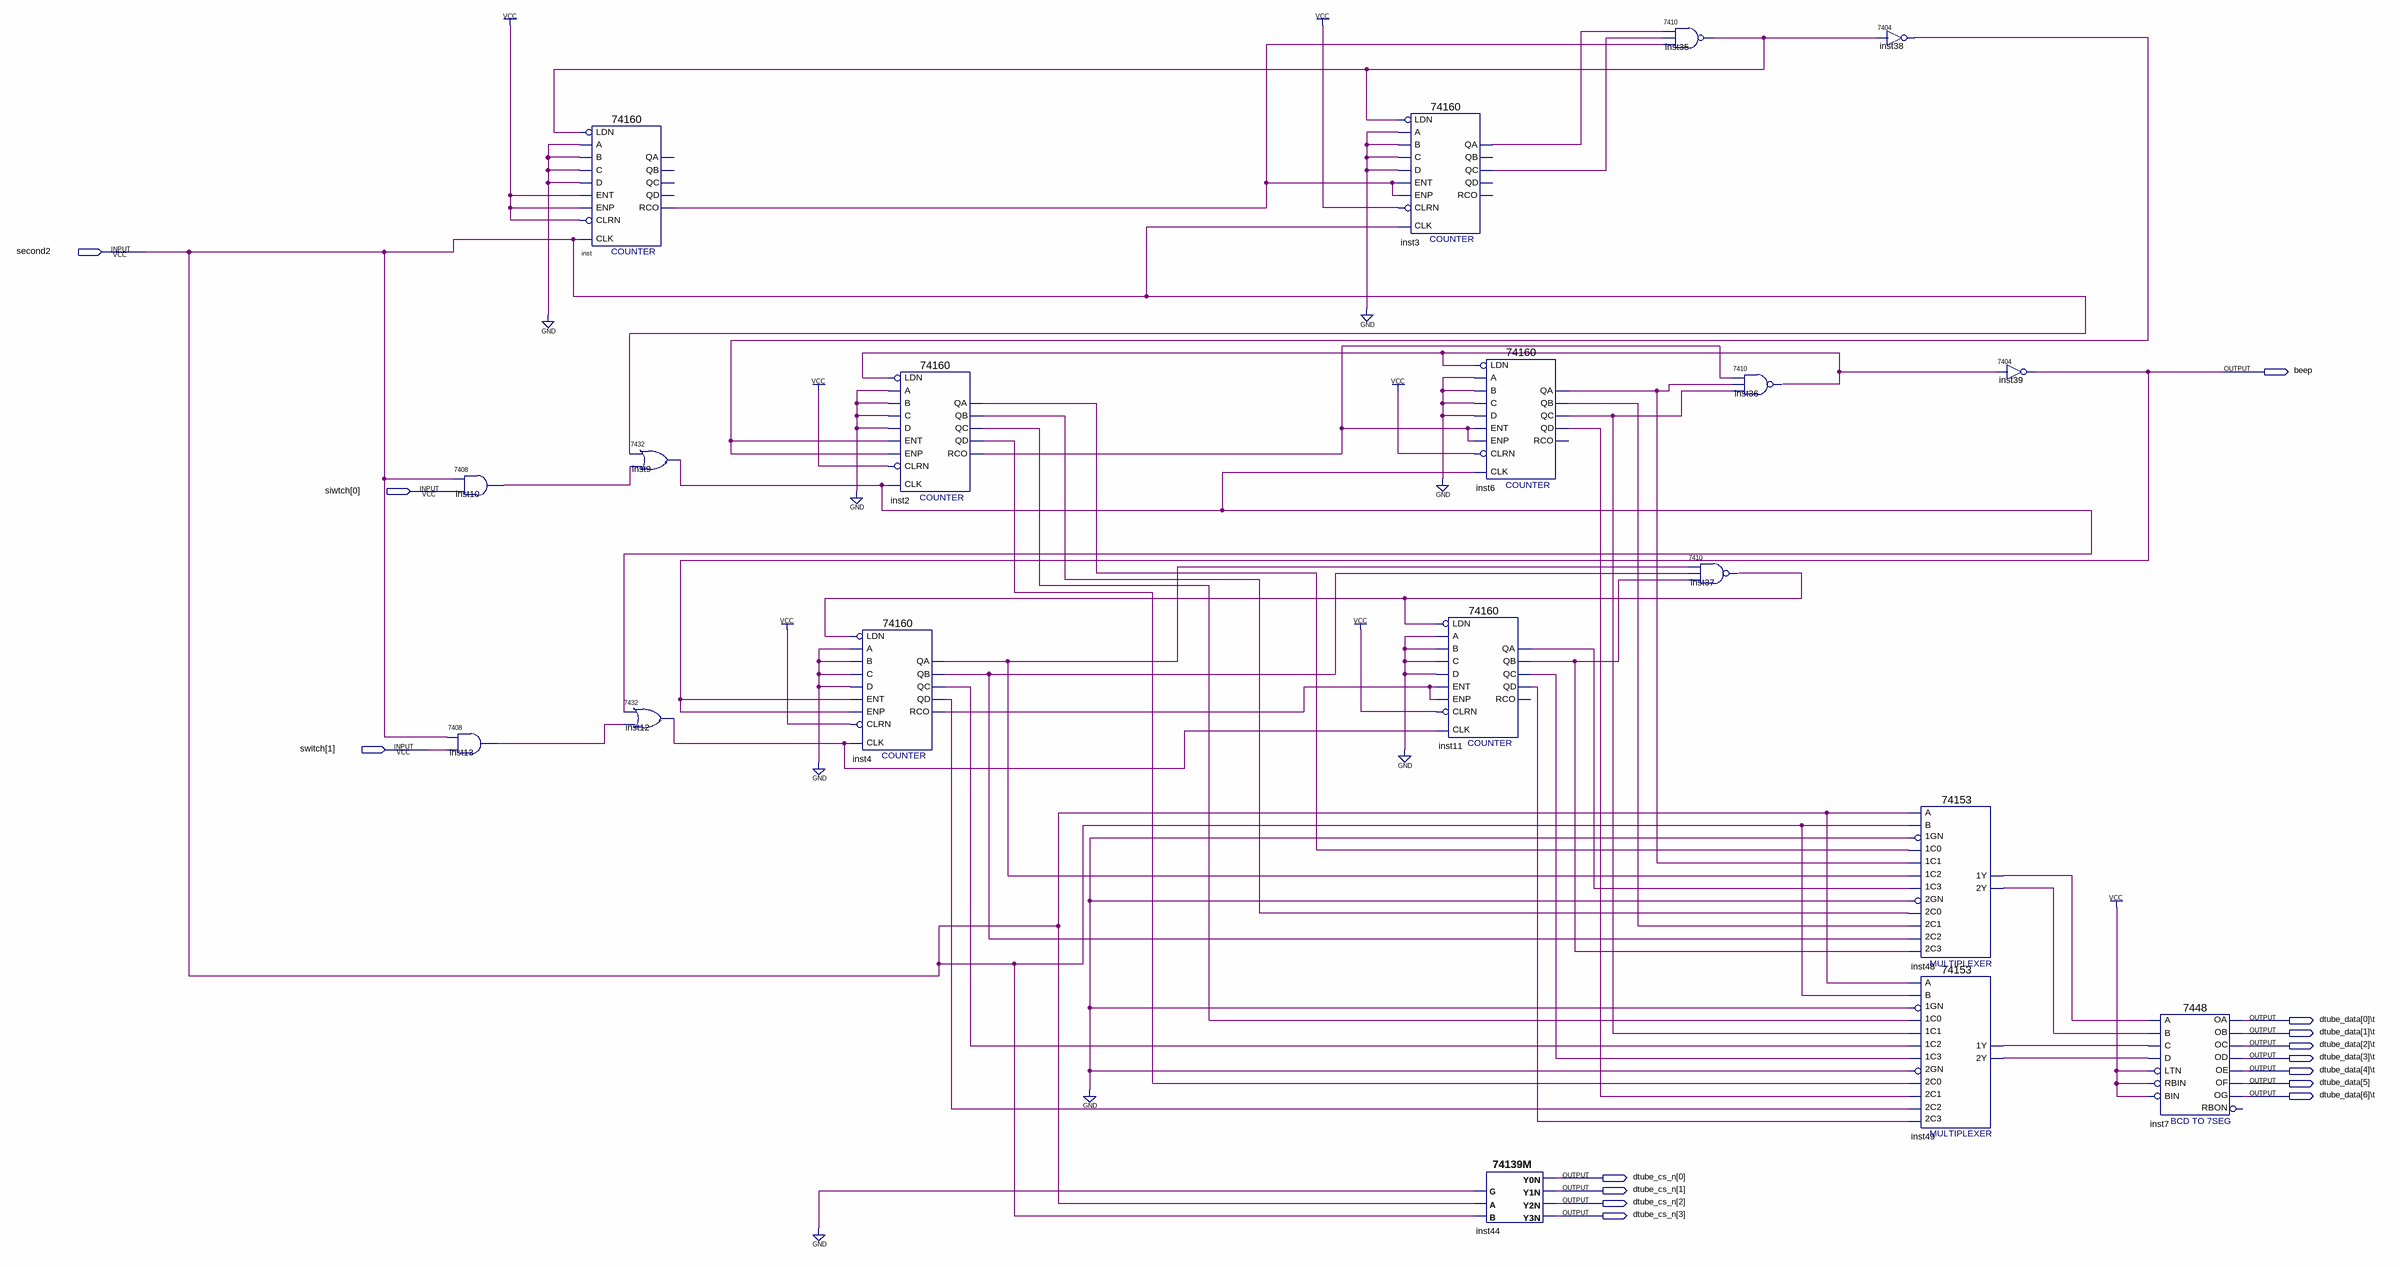
[diagram p0: schematic sheet]
// Quartus schematic final.bdf as structural Verilog: 19 symbols, 15 pins
module \final  (
  input  second2,
  input  [0:0] siwtch,
  input  [1:1] switch,
  output beep,
  output \dtube_data[0]\t ,
  output \dtube_data[1]\t ,
  output \dtube_data[2]\t ,
  output \dtube_data[3]\t ,
  output \dtube_data[4]\t ,
  output [5:5] dtube_data,
  output \dtube_data[6]\t ,
  output [3:0] dtube_cs_n
);

  wire inst2_qa, inst2_qb, inst2_qc, inst2_qd, inst2_rco, inst3_qa, inst3_qc, inst4_qa, inst4_qb, inst4_qc,
       inst4_qd, inst4_rco, inst6_qa, inst6_qb, inst6_qc, inst6_qd, inst9_1, inst10_1, inst11_qa, inst11_qb,
       inst11_qc, inst11_qd, inst12_1, inst13_1, inst35_1, inst36_1, inst37_1, inst38_1, inst48_1y,
       inst48_2y, inst49_1y, inst49_2y, inst_rco;

  \7408  inst10 (.\3 (siwtch[0]), .\2 (second2), .\1 (inst10_1));
  \7408  inst13 (.\3 (switch[1]), .\2 (second2), .\1 (inst13_1));
  \74160  inst (
    .CLK(second2), .ENT(1'b1), .A(1'b0), .B(1'b0), .C(1'b0), .D(1'b0), .LDN(inst35_1), .ENP(1'b1),
    .CLRN(1'b1), .RCO(inst_rco));  // open: QD, QA, QB, QC
  \7432  inst12 (.\2 (inst9_1), .\3 (inst13_1), .\1 (inst12_1));
  \7432  inst9 (.\2 (second2), .\3 (inst10_1), .\1 (inst9_1));
  \74160  inst4 (
    .CLK(inst12_1), .ENT(beep), .A(1'b0), .B(1'b0), .C(1'b0), .D(1'b0), .LDN(inst37_1), .ENP(beep),
    .CLRN(1'b1), .QD(inst4_qd), .QA(inst4_qa), .QB(inst4_qb), .QC(inst4_qc), .RCO(inst4_rco));
  \74160  inst2 (
    .CLK(inst9_1), .ENT(inst38_1), .A(1'b0), .B(1'b0), .C(1'b0), .D(1'b0), .LDN(inst36_1), .ENP(inst38_1),
    .CLRN(1'b1), .QD(inst2_qd), .QA(inst2_qa), .QB(inst2_qb), .QC(inst2_qc), .RCO(inst2_rco));
  \74160  inst3 (
    .CLK(second2), .ENT(inst_rco), .A(1'b0), .B(1'b0), .C(1'b0), .D(1'b0), .LDN(inst35_1), .ENP(inst_rco),
    .CLRN(1'b1), .QA(inst3_qa), .QC(inst3_qc));  // open: QD, QB, RCO
  \74160  inst6 (
    .CLK(inst9_1), .ENT(inst2_rco), .A(1'b0), .B(1'b0), .C(1'b0), .D(1'b0), .LDN(inst36_1), .ENP(inst2_rco),
    .CLRN(1'b1), .QD(inst6_qd), .QA(inst6_qa), .QB(inst6_qb), .QC(inst6_qc));  // open: RCO
  \74160  inst11 (
    .CLK(inst12_1), .ENT(inst4_rco), .A(1'b0), .B(1'b0), .C(1'b0), .D(1'b0), .LDN(inst37_1), .ENP(inst4_rco),
    .CLRN(1'b1), .QD(inst11_qd), .QA(inst11_qa), .QB(inst11_qb), .QC(inst11_qc));  // open: RCO
  \74139M  inst44 (
    .B(second2), .A(second2), .G(1'b0), .Y3N(dtube_cs_n[3]), .Y2N(dtube_cs_n[2]), .Y0N(dtube_cs_n[0]),
    .Y1N(dtube_cs_n[1]));
  \7410  inst35 (.\2 (inst3_qa), .\3 (inst3_qc), .\4 (inst_rco), .\1 (inst35_1));
  \7410  inst36 (.\2 (inst2_rco), .\3 (inst6_qa), .\4 (inst6_qc), .\1 (inst36_1));
  \7410  inst37 (.\2 (inst4_qa), .\3 (inst4_qb), .\4 (inst11_qb), .\1 (inst37_1));
  \7404  inst38 (.\2 (inst35_1), .\1 (inst38_1));
  \74153  inst48 (
    .\1C1 (inst6_qa), .\1GN (1'b0), .\1C0 (inst2_qa), .\2C0 (inst2_qb), .\2GN (1'b0), .\2C2 (inst4_qb),
    .\1C2 (inst4_qa), .\1C3 (inst11_qa), .B(second2), .A(second2), .\2C1 (inst6_qb), .\2C3 (inst11_qb),
    .\1Y (inst48_1y), .\2Y (inst48_2y));
  \74153  inst49 (
    .\1C1 (inst6_qc), .\1GN (1'b0), .\1C0 (inst2_qc), .\2C0 (inst2_qd), .\2GN (1'b0), .\2C2 (inst4_qd),
    .\1C2 (inst4_qc), .\1C3 (inst11_qc), .B(second2), .A(second2), .\2C1 (inst6_qd), .\2C3 (inst11_qd),
    .\1Y (inst49_1y), .\2Y (inst49_2y));
  \7404  inst39 (.\2 (inst36_1), .\1 (beep));
  \7448  inst7 (
    .A(inst48_1y), .C(inst49_1y), .D(inst49_2y), .B(inst48_2y), .RBIN(1'b1), .BIN(1'b1), .LTN(1'b1),
    .OC(\dtube_data[2]\t ), .OE(\dtube_data[4]\t ), .OD(\dtube_data[3]\t ), .OF(dtube_data[5]),
    .OG(\dtube_data[6]\t ), .OB(\dtube_data[1]\t ), .OA(\dtube_data[0]\t ));  // open: RBON
endmodule
